# EAGLE schematic DC_DC_V1.4.2-1(top) (EAGLE 7.7.0)
CNAME: DC/DC board for 2016-2017; CREVISION: V1.3; DESIGNER: Sylvia Fu
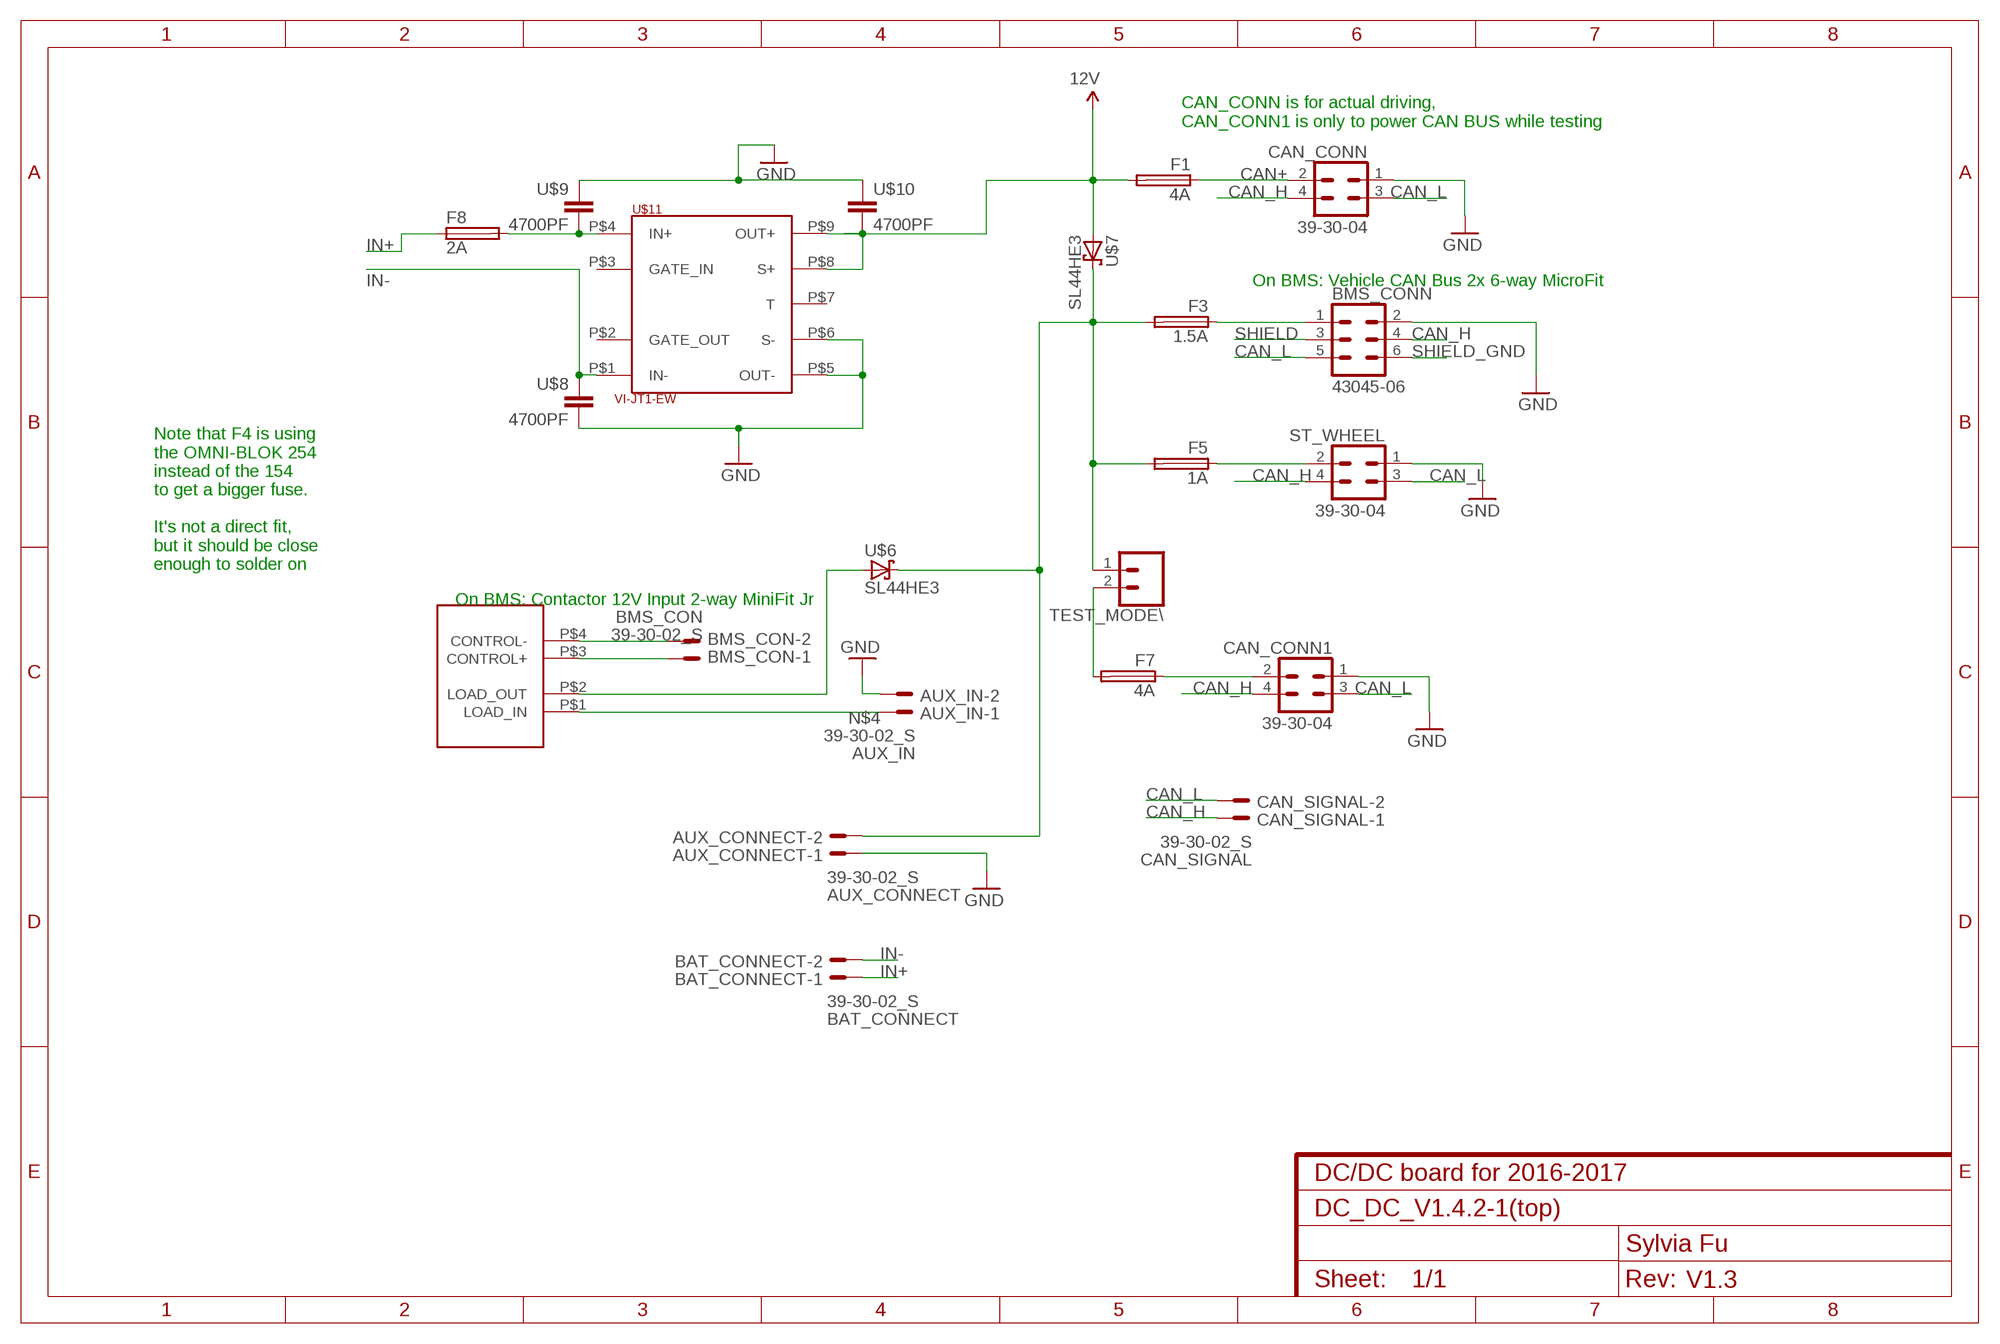
[diagram p0: schematic, sheet 1]

## Parts
AUX_CONNECT  39-30-02_S  [39-30-?02?]
AUX_IN  39-30-02_S  [39-30-?02?]
BAT_CONNECT  39-30-02_S  [39-30-?02?]
BMS_CON  39-30-02_S  [39-30-?02?]
BMS_CONN  43045-06  [43045-06]
CAN_CONN  39-30-04  [39-30-?04?]
CAN_CONN1  39-30-04  [39-30-?04?]
CAN_SIGNAL  39-30-02_S  [39-30-?02?]
F1  4A  SMD-MICRO-FUSE-BLOCK  [OMNIBLOK]
F3  1.5A  SMD-MICRO-FUSE-BLOCK  [OMNIBLOK]
F5  1A  SMD-MICRO-FUSE-BLOCK  [OMNIBLOK]
F7  4A  SMD-MICRO-FUSE-BLOCK  [OMNIBLOK]
F8  2A  SMD-MICRO-FUSE-BLOCK  [OMNIBLOK]
ST_WHEEL  39-30-04  [39-30-?04?]
TEST_MODE\  CONN_02  [1X02]
U$2  MPDCD3B  [MPDCD3B]
U$6  SL44HE3  [SMC]
U$7  SL44HE3  [SMC]
U$8  4700PF  [Y2_CAP]
U$9  4700PF  [Y2_CAP]
U$10  4700PF  [Y2_CAP]
U$11  VI-JT1-EW  [VI-J00]

## Nets
12V: F1.P$2 U$7.A U$10.P$2 U$11.P$8(S+) U$11.P$9(OUT+)
AUX_12V: AUX_CONNECT.2 F3.P$2 F5.P$2 TEST_MODE\.1 U$6.C U$7.C
CAN+: CAN_CONN.2 F1.P$1
CAN_H: BMS_CONN.4 CAN_CONN1.4 CAN_CONN.4 CAN_SIGNAL.1 ST_WHEEL.4
CAN_L: BMS_CONN.5 CAN_CONN1.3 CAN_CONN.3 CAN_SIGNAL.2 ST_WHEEL.3
GND: AUX_CONNECT.1 AUX_IN.2 BMS_CONN.2 CAN_CONN1.1 CAN_CONN.1 ST_WHEEL.1 U$8.P$2 U$9.P$1 U$10.P$1 U$11.P$5(OUT-) U$11.P$6(S-)
IN+: BAT_CONNECT.1 F8.P$1
IN-: BAT_CONNECT.2 U$8.P$1 U$11.P$1(IN-)
N$1: AUX_IN.1 U$2.P$1(LOAD_IN)
N$2: BMS_CON.1 U$2.P$3(CONTROL+)
N$3: BMS_CON.2 U$2.P$4(CONTROL-)
N$4: U$2.P$2(LOAD_OUT) U$6.A
N$6: BMS_CONN.1 F3.P$1
N$7: F5.P$1 ST_WHEEL.2
N$10: CAN_CONN1.2 F7.P$1
N$12: F8.P$2 U$9.P$2 U$11.P$4(IN+)
N$13: F7.P$2 TEST_MODE\.2
SHIELD: BMS_CONN.3
SHIELD_GND: BMS_CONN.6
Unconnected: U$11.P$2(GATE_OUT) U$11.P$3(GATE_IN) U$11.P$7(T)

## Notes on the sheet
- CAN_CONN is for actual driving,
  CAN_CONN1 is only to power CAN BUS while testing
- On BMS: Vehicle CAN Bus 2x 6-way MicroFit
- Note that F4 is using
  the OMNI-BLOK 254
  instead of the 154
  to get a bigger fuse.
  
  It's not a direct fit,
  but it should be close
  enough to solder on
- On BMS: Contactor 12V Input 2-way MiniFit Jr

## Library data of the parts
AUX_CONNECT AUX_IN BAT_CONNECT BMS_CON CAN_SIGNAL = con-molex-mini-fit:39-30-?02?_S: HEADER
BMS_CONN = con-molex-micro-fit:43045-06: HEADER
CAN_CONN CAN_CONN1 ST_WHEEL = con-molex-mini-fit:39-30-?04?: HEADER
F1 F3 F5 F7 F8 = f-lf-omniblok-s:SMD-MICRO-FUSE
TEST_MODE\ = SparkFun-Connectors:CONN_02: Multi connection point. Often used as Generic Header-pin footprint for 0.1 inch spaced/style header connections On any of the 0.1 inch spaced packages, you can populate with these: Break Away Headers - Straight <https://www.sparkfun.com/products/116> (PRT-00116) Break Away Male Headers - Right Angle <https://www.sparkfun.com/products/553> (PRT-00553) Female Headers <https://www.sparkfun.com/products/115> (PRT-00115) Break Away Headers - Machine Pin <https://www.sparkfun.com/products/117> (PRT-00117) Break Away Female Headers - Swiss Machine Pin <https://www.sparkfun.com/products/743> (PRT-00743) For SCREWTERMINALS and SPRING TERMINALS visit here: Screw Terimnals on SparkFun.com <https://www.sparkfun.com/search/results?term=Screw+Terminals> (5mm/3.5mm/2.54mm spacing) This device is also useful as a general connection point to wire up your design to another part of your project. Our various solder wires solder well into these plated through hole pads. Hook-Up Wire - Assortment (Stranded, 22 AWG) <https://www.sparkfun.com/products/11375> (PRT-11375) Hook-Up Wire - Assortment (Solid Core, 22 AWG) <https://www.sparkfun.com/products/11367> (PRT-11367) View the entire wire category on our website here <https://www.sparkfun.com/categories/141> Special notes: Molex polarized connector foot print use with: PRT-08233 with associated crimp pins and housings. 2.54_SCREWTERM for use with PRT-10571. 3.5mm Screw Terminal footprints for PRT-08084 5mm Screw Terminal footprints for use with PRT-08432
U$2 = NUSOLAR_Custom:MPDCD3B
U$6 U$7 = diode:SL44HE3
U$8-U$10 = NUSOLAR_Custom:4700PF
U$11 = NUSOLAR_Custom:VI-JT1-EW